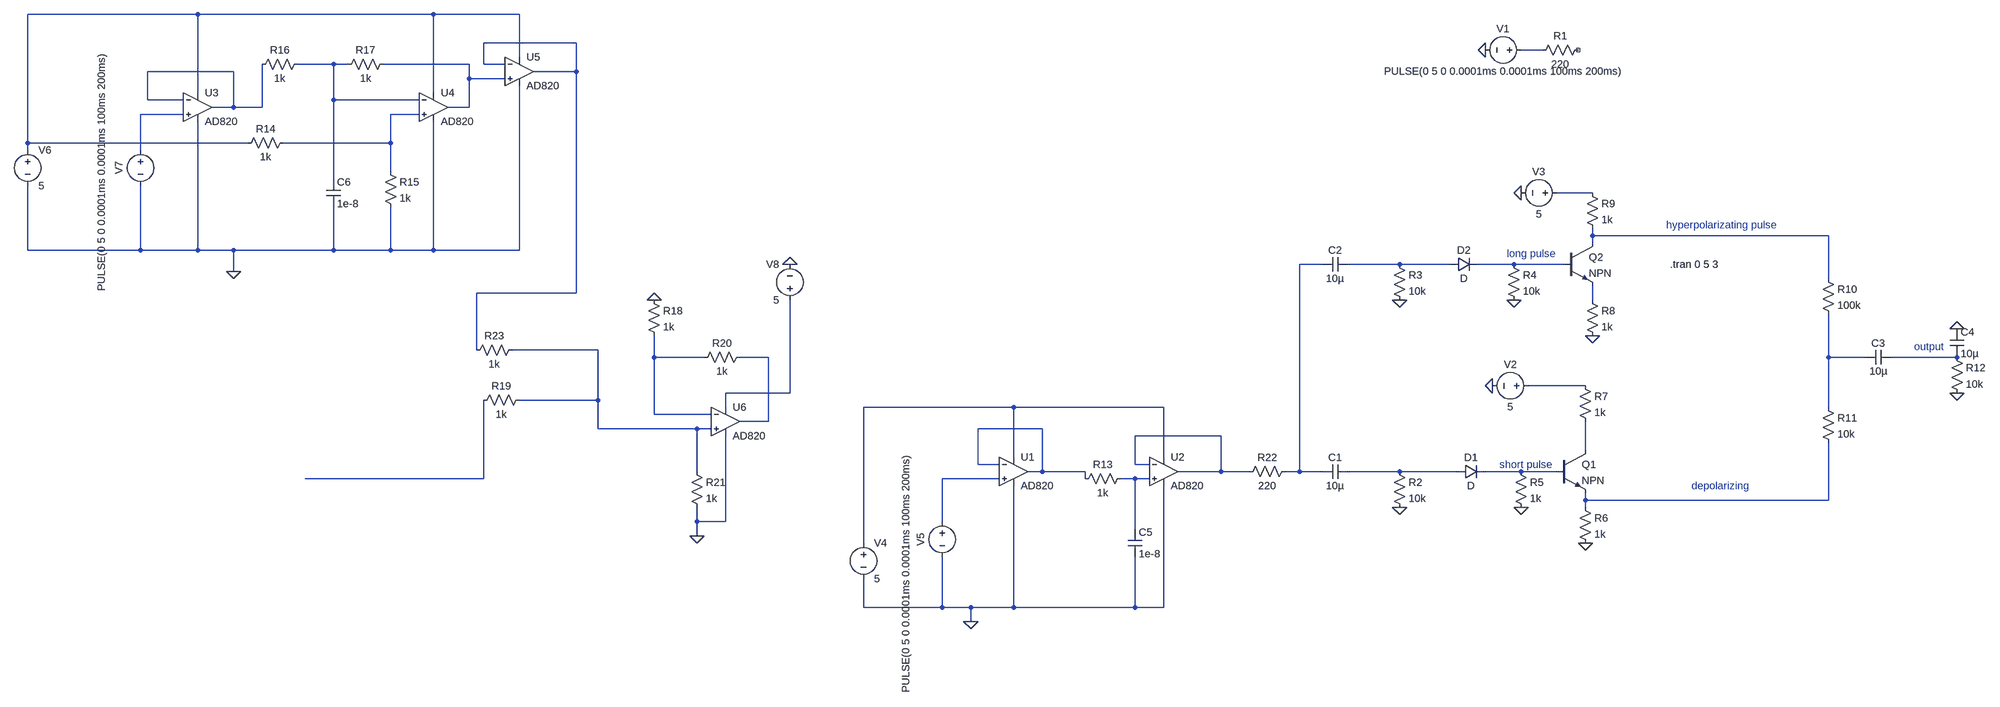
[diagram p0: schematic NeuroSim-modified.asc]
NeuroSim-modified.asc, the LTspice schematic file:
Version 4.1
SHEET 1 1860 1236
WIRE -3200 -768 -3584 -768
WIRE -2672 -768 -3200 -768
WIRE -2480 -768 -2672 -768
WIRE -2352 -704 -2560 -704
WIRE 784 -688 736 -688
WIRE -2480 -672 -2480 -768
WIRE -2896 -656 -2976 -656
WIRE -2864 -656 -2896 -656
WIRE -2592 -656 -2784 -656
WIRE -2560 -656 -2560 -704
WIRE -2512 -656 -2560 -656
WIRE -3120 -640 -3312 -640
WIRE -2352 -640 -2352 -704
WIRE -2352 -640 -2448 -640
WIRE -2592 -624 -2592 -656
WIRE -2512 -624 -2592 -624
WIRE -3200 -592 -3200 -768
WIRE -2672 -592 -2672 -768
WIRE -3312 -576 -3312 -640
WIRE -3232 -576 -3312 -576
WIRE -2896 -576 -2896 -656
WIRE -2704 -576 -2896 -576
WIRE -3120 -560 -3120 -640
WIRE -3120 -560 -3168 -560
WIRE -3056 -560 -3056 -656
WIRE -3056 -560 -3120 -560
WIRE -2592 -560 -2592 -624
WIRE -2592 -560 -2640 -560
WIRE -3232 -544 -3328 -544
WIRE -2704 -544 -2768 -544
WIRE -3584 -480 -3584 -768
WIRE -3088 -480 -3584 -480
WIRE -2768 -480 -2768 -544
WIRE -2768 -480 -3008 -480
WIRE -3584 -464 -3584 -480
WIRE -3328 -464 -3328 -544
WIRE -2768 -416 -2768 -480
WIRE -2896 -400 -2896 -576
WIRE 896 -368 816 -368
WIRE 896 -272 896 -288
WIRE 1504 -272 896 -272
WIRE 896 -256 896 -272
WIRE -3584 -240 -3584 -384
WIRE -3328 -240 -3328 -384
WIRE -3328 -240 -3584 -240
WIRE -3200 -240 -3200 -528
WIRE -3200 -240 -3328 -240
WIRE -3120 -240 -3200 -240
WIRE -2896 -240 -2896 -336
WIRE -2896 -240 -3120 -240
WIRE -2768 -240 -2768 -336
WIRE -2768 -240 -2896 -240
WIRE -2672 -240 -2672 -528
WIRE -2672 -240 -2768 -240
WIRE -2480 -240 -2480 -608
WIRE -2480 -240 -2672 -240
WIRE 288 -208 240 -208
WIRE 464 -208 352 -208
WIRE 576 -208 464 -208
WIRE 720 -208 640 -208
WIRE 832 -208 720 -208
WIRE -3120 -192 -3120 -240
WIRE 1504 -176 1504 -272
WIRE -2352 -144 -2352 -640
WIRE -2352 -144 -2576 -144
WIRE 896 -128 896 -160
WIRE -2576 -16 -2576 -144
WIRE -2304 -16 -2496 -16
WIRE -2080 0 -2080 -48
WIRE -1968 0 -2080 0
WIRE -1824 0 -1888 0
WIRE 1504 0 1504 -96
WIRE 1584 0 1504 0
WIRE 1792 0 1648 0
WIRE 880 64 752 64
WIRE -1776 80 -1776 -128
WIRE -1776 80 -1920 80
WIRE -2304 96 -2304 -16
WIRE -2304 96 -2480 96
WIRE -1920 112 -1920 80
WIRE -400 112 -736 112
WIRE -64 112 -400 112
WIRE 1504 112 1504 0
WIRE -2080 128 -2080 0
WIRE -1952 128 -2080 128
WIRE -1824 144 -1824 0
WIRE -1824 144 -1888 144
WIRE -2304 160 -2304 96
WIRE -1984 160 -2304 160
WIRE -1952 160 -1984 160
WIRE -336 160 -480 160
WIRE 64 176 -128 176
WIRE 880 208 880 144
WIRE -400 224 -400 112
WIRE -64 224 -64 112
WIRE -480 240 -480 160
WIRE -432 240 -480 240
WIRE -128 240 -128 176
WIRE -96 240 -128 240
WIRE -1984 256 -1984 160
WIRE -336 256 -336 160
WIRE -336 256 -368 256
WIRE -240 256 -336 256
WIRE 64 256 64 176
WIRE 64 256 -32 256
WIRE 128 256 64 256
WIRE 240 256 240 -208
WIRE 240 256 208 256
WIRE 288 256 240 256
WIRE 464 256 352 256
WIRE 592 256 464 256
WIRE 736 256 656 256
WIRE 816 256 736 256
WIRE -2560 272 -2560 96
WIRE -2560 272 -2960 272
WIRE -432 272 -560 272
WIRE -240 272 -240 256
WIRE -128 272 -160 272
WIRE -96 272 -128 272
WIRE 880 320 880 304
WIRE 1504 320 1504 192
WIRE 1504 320 880 320
WIRE 880 336 880 320
WIRE -1984 368 -1984 336
WIRE -1920 368 -1920 176
WIRE -1920 368 -1984 368
WIRE -560 368 -560 272
WIRE -128 384 -128 272
WIRE -1984 400 -1984 368
WIRE -736 416 -736 112
WIRE -736 560 -736 496
WIRE -560 560 -560 448
WIRE -560 560 -736 560
WIRE -496 560 -560 560
WIRE -400 560 -400 288
WIRE -400 560 -496 560
WIRE -128 560 -128 448
WIRE -128 560 -400 560
WIRE -64 560 -64 288
WIRE -64 560 -128 560
WIRE -496 592 -496 560
FLAG 656 -688 0
FLAG 464 -128 0
FLAG 720 -128 0
FLAG 464 336 0
FLAG 736 336 0
FLAG 672 64 0
FLAG 880 416 0
FLAG 896 -48 0
FLAG 736 -368 0
FLAG 1792 -64 0
FLAG 1792 80 0
FLAG -496 592 0
FLAG -3120 -192 0
FLAG -1984 400 0
FLAG -1776 -208 0
FLAG -2080 -128 0
SYMBOL voltage 752 -688 R90
WINDOW 0 -32 56 VBottom 2
WINDOW 3 32 56 VTop 2
WINDOW 123 0 0 Left 0
WINDOW 39 0 0 Left 0
SYMATTR InstName V1
SYMATTR Value PULSE(0 5 0 0.0001ms 0.0001ms 100ms 200ms)
SYMBOL res 768 -672 R270
WINDOW 0 32 56 VTop 2
WINDOW 3 0 56 VBottom 2
SYMATTR InstName R1
SYMATTR Value 220
SYMBOL cap 352 240 R90
WINDOW 0 0 32 VBottom 2
WINDOW 3 32 32 VTop 2
SYMATTR InstName C1
SYMATTR Value 10µ
SYMBOL res 448 240 R0
SYMATTR InstName R2
SYMATTR Value 10k
SYMBOL diode 592 272 R270
WINDOW 0 32 32 VTop 2
WINDOW 3 0 32 VBottom 2
SYMATTR InstName D1
SYMBOL cap 352 -224 R90
WINDOW 0 0 32 VBottom 2
WINDOW 3 32 32 VTop 2
SYMATTR InstName C2
SYMATTR Value 10µ
SYMBOL res 448 -224 R0
SYMATTR InstName R3
SYMATTR Value 10k
SYMBOL res 704 -224 R0
SYMATTR InstName R4
SYMATTR Value 10k
SYMBOL diode 576 -192 R270
WINDOW 0 32 32 VTop 2
WINDOW 3 0 32 VBottom 2
SYMATTR InstName D2
SYMBOL res 720 240 R0
SYMATTR InstName R5
SYMATTR Value 1k
SYMBOL voltage 768 64 R90
WINDOW 0 -32 56 VBottom 2
WINDOW 3 32 56 VTop 2
WINDOW 123 0 0 Left 0
WINDOW 39 0 0 Left 0
SYMATTR InstName V2
SYMATTR Value 5
SYMBOL npn 816 208 R0
SYMATTR InstName Q1
SYMBOL npn 832 -256 R0
SYMATTR InstName Q2
SYMBOL res 864 320 R0
SYMATTR InstName R6
SYMATTR Value 1k
SYMBOL res 864 48 R0
SYMATTR InstName R7
SYMATTR Value 1k
SYMBOL res 880 -144 R0
SYMATTR InstName R8
SYMATTR Value 1k
SYMBOL res 880 -384 R0
SYMATTR InstName R9
SYMATTR Value 1k
SYMBOL voltage 832 -368 R90
WINDOW 0 -32 56 VBottom 2
WINDOW 3 32 56 VTop 2
WINDOW 123 0 0 Left 0
WINDOW 39 0 0 Left 0
SYMATTR InstName V3
SYMATTR Value 5
SYMBOL res 1488 -192 R0
SYMATTR InstName R10
SYMATTR Value 100k
SYMBOL res 1488 96 R0
SYMATTR InstName R11
SYMATTR Value 10k
SYMBOL res 1776 -16 R0
SYMATTR InstName R12
SYMATTR Value 10k
SYMBOL cap 1776 -64 R0
SYMATTR InstName C4
SYMATTR Value 10µ
SYMBOL cap 1648 -16 R90
WINDOW 0 0 32 VBottom 2
WINDOW 3 32 32 VTop 2
SYMATTR InstName C3
SYMATTR Value 10µ
SYMBOL voltage -736 400 R0
WINDOW 123 0 0 Left 0
WINDOW 39 0 0 Left 0
SYMATTR InstName V4
SYMATTR Value 5
SYMBOL voltage -560 352 R0
WINDOW 0 -32 56 VBottom 2
WINDOW 3 -65 133 VBottom 2
WINDOW 123 0 0 Left 0
WINDOW 39 0 0 Left 0
SYMATTR InstName V5
SYMATTR Value PULSE(0 5 0 0.0001ms 0.0001ms 100ms 200ms)
SYMBOL res -144 256 R90
WINDOW 0 0 56 VBottom 2
WINDOW 3 32 56 VTop 2
SYMATTR InstName R13
SYMATTR Value 1k
SYMBOL cap -144 384 R0
SYMATTR InstName C5
SYMATTR Value 1e-8
SYMBOL OpAmps\\AD820 -400 192 R0
SYMATTR InstName U1
SYMBOL OpAmps\\AD820 -64 192 R0
SYMATTR InstName U2
SYMBOL voltage -3584 -480 R0
WINDOW 123 0 0 Left 0
WINDOW 39 0 0 Left 0
SYMATTR InstName V6
SYMATTR Value 5
SYMBOL voltage -3328 -480 R0
WINDOW 0 -32 56 VBottom 2
WINDOW 3 -71 66 VBottom 2
WINDOW 123 0 0 Left 0
WINDOW 39 0 0 Left 0
SYMATTR InstName V7
SYMATTR Value PULSE(0 5 0 0.0001ms 0.0001ms 100ms 200ms)
SYMBOL OpAmps\\AD820 -3200 -624 R0
SYMATTR InstName U3
SYMBOL cap -2912 -400 R0
SYMATTR InstName C6
SYMATTR Value 1e-8
SYMBOL res -2992 -496 R90
WINDOW 0 0 56 VBottom 2
WINDOW 3 32 56 VTop 2
SYMATTR InstName R14
SYMATTR Value 1k
SYMBOL res -2784 -432 R0
SYMATTR InstName R15
SYMATTR Value 1k
SYMBOL OpAmps\\AD820 -2672 -624 R0
SYMATTR InstName U4
SYMBOL OpAmps\\AD820 -2480 -704 R0
SYMATTR InstName U5
SYMBOL res -2960 -672 R90
WINDOW 0 0 56 VBottom 2
WINDOW 3 32 56 VTop 2
SYMATTR InstName R16
SYMATTR Value 1k
SYMBOL res -2768 -672 R90
WINDOW 0 0 56 VBottom 2
WINDOW 3 32 56 VTop 2
SYMATTR InstName R17
SYMATTR Value 1k
SYMBOL OpAmps\\AD820 -1920 80 R0
SYMATTR InstName U6
SYMBOL res -2096 -144 R0
SYMATTR InstName R18
SYMATTR Value 1k
SYMBOL res -1872 -16 R90
WINDOW 0 0 56 VBottom 2
WINDOW 3 32 56 VTop 2
SYMATTR InstName R20
SYMATTR Value 1k
SYMBOL res -2000 240 R0
SYMATTR InstName R21
SYMATTR Value 1k
SYMBOL voltage -1776 -112 R180
WINDOW 0 24 96 Left 2
WINDOW 3 24 16 Left 2
WINDOW 123 0 0 Left 0
WINDOW 39 0 0 Left 0
SYMATTR InstName V8
SYMATTR Value 5
SYMBOL res 112 272 R270
WINDOW 0 32 56 VTop 2
WINDOW 3 0 56 VBottom 2
SYMATTR InstName R22
SYMATTR Value 220
SYMBOL res -2464 80 R90
WINDOW 0 0 56 VBottom 2
WINDOW 3 32 56 VTop 2
SYMATTR InstName R19
SYMATTR Value 1k
SYMBOL res -2480 -32 R90
WINDOW 0 0 56 VBottom 2
WINDOW 3 32 56 VTop 2
SYMATTR InstName R23
SYMATTR Value 1k
TEXT 1096 -208 Left 2 !.tran 0 5 3
TEXT 1088 -296 Left 2 ;hyperpolarizating pulse
TEXT 1144 288 Left 2 ;depolarizing
TEXT 688 240 Left 2 ;short pulse
TEXT 704 -232 Left 2 ;long pulse
TEXT 1696 -24 Left 2 ;output

The netlist it stands for:
* NeuroSim-modified.asc
V1 N003 0 PULSE(0 5 0 0.0001ms 0.0001ms 100ms 200ms)
R1 N003 NC_01 220
C1 N026 N011 10µ
R2 N026 0 10k
D1 N026 N027 D
C2 N012 N011 10µ
R3 N012 0 10k
R4 N013 0 10k
D2 N012 N013 D
R5 N027 0 1k
V2 N020 0 5
Q1 N025 N027 N031 0 NPN
Q2 N010 N013 N014 0 NPN
R6 N031 0 1k
R7 N020 N025 1k
R8 N014 0 1k
R9 N009 N010 1k
V3 N009 0 5
R10 N010 N018 100k
R11 N018 N031 10k
R12 N019 0 10k
C4 0 N019 10µ
C3 N019 N018 10µ
V4 N022 0 5
V5 N029 0 PULSE(0 5 0 0.0001ms 0.0001ms 100ms 200ms)
R13 N030 N023 1k
C5 N030 0 1e-8
X§U1 N029 N023 N022 0 N023 AD820  ; pins In+ In- V+ V- OUT
X§U2 N030 N024 N022 0 N024 AD820  ; pins In+ In- V+ V- OUT
V6 N001 0 5
V7 N007 0 PULSE(0 5 0 0.0001ms 0.0001ms 100ms 200ms)
X§U3 N007 N006 N001 0 N006 AD820  ; pins In+ In- V+ V- OUT
C6 N004 0 1e-8
R14 N008 N001 1k
R15 N008 0 1k
X§U4 N008 N004 N001 0 N005 AD820  ; pins In+ In- V+ V- OUT
X§U5 N005 N002 N001 0 N002 AD820  ; pins In+ In- V+ V- OUT
R16 N004 N006 1k
R17 N005 N004 1k
X§U6 N015 N016 N021 0 N017 AD820  ; pins In+ In- V+ V- OUT
R18 0 N016 1k
R20 N017 N016 1k
R21 N015 0 1k
V8 N021 0 5
R22 N024 N011 220
R19 N015 N028 1k
R23 N015 N002 1k
.model D D
.lib standard.dio
.model NPN NPN
.model PNP PNP
.lib standard.bjt
.tran 0 5 3
* hyperpolarizating pulse
* depolarizing
* short pulse
* long pulse
* output
.backanno
.end